# Altium schematic sheet 01-POWER.SchDoc
size A4
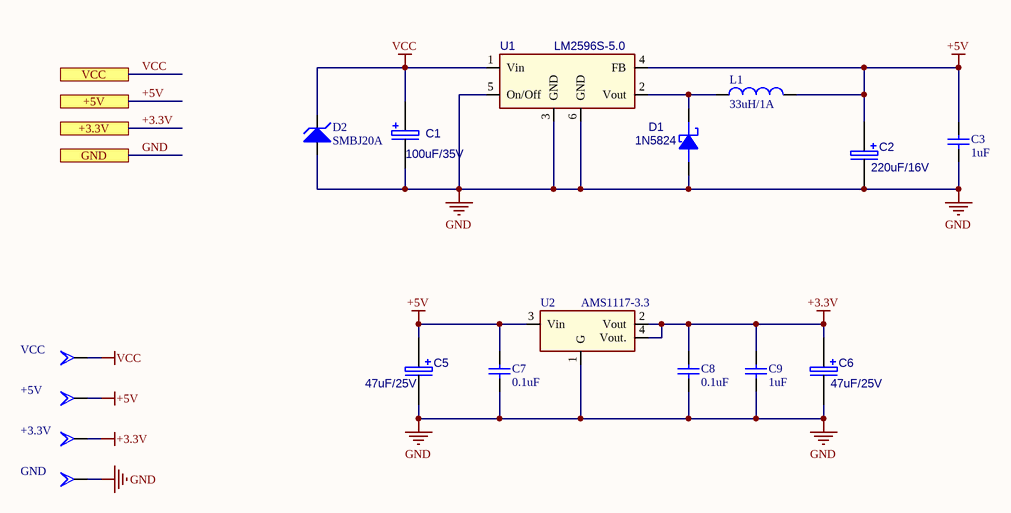
[diagram p0: 01-POWER.SchDoc]

## Parts
+3.3V  T POINT A  [TP_60_30]  (value not drawn)
+5V  T POINT A  [TP_60_30]  (value not drawn)
C1  100uF/35V  [CE06150]
C2  220uF/16V  [CE06150 - W]
C3  1uF  [0805_C]
C5  47uF/25V  [CE06150 - W]
C6  47uF/25V  [CE06150 - W]
C7  0.1uF  [0805_C]
C8  0.1uF  [0805_C]
C9  1uF  [0805_C]
D1  1N5824  [SMB-DO-214AA_DIOM4436X24N]
D2  SMBJ20A  [SMB-DO-214AA_DIOM4436X24N]
GND  T POINT A  [TP_60_30]  (value not drawn)
L1  33uH/1A  [SMD_S7-7-5]
U1  LM2596S-5.0  [TO-263-5]
U2  AMS1117-3.3  [SOT223]
VCC  T POINT A  [TP_60_30]  (value not drawn)

## Ports
+3.3V, +5V, GND, VCC

## Nets
+3.3V: +3.3V.1(TP) C6.1(+) C8.2 C9.2 U2.2(Vout) U2.4(Vout.) ; port +3.3V
+5V: +5V.1(TP) C2.1(+) C3.2 C5.1(+) C7.2 L1.2 U1.4(FB) U2.3(Vin) ; port +5V
GND: C1.2(-) C2.2(-) C3.1 C5.2(-) C6.2(-) C7.1 C8.1 C9.1 D1.1(ANODE) D2.1(A) GND.1(TP) U1.3(GND) U1.5(On/Off) U1.6(GND) U2.1(G) ; port GND
VCC: C1.1(+) D2.2(K) U1.1(Vin) VCC.1(TP) ; port VCC
NetD1_2: D1.2(CATHODE) L1.1 U1.2(Vout)

## Library data of the parts
C1 C2 C5 C6 = ECAP: E-CAP
C3 = Cap Semi: Capacitor; Published: 8-Jun-2000; LatestRevisionDate: 29-May-2009; LatestRevisionNote: IPC-7351 Footprint Added.; PackageReference: C1206; Publisher: Altium Limited; PackageDescription: Chip Capacitor
C7-C9 = Cap Semi_1: Capacitor; Published: 8-Jun-2000; LatestRevisionDate: 29-May-2009; LatestRevisionNote: IPC-7351 Footprint Added.; PackageReference: C1206; Publisher: Altium Limited; PackageDescription: Chip Capacitor
D1 = DIODE SCHOTTKY
D2 = D Zener: TVS; Published: 8-Jun-2000; LatestRevisionDate: 17-Jul-2002; LatestRevisionNote: Re-released for DXP Platform.; PackageReference: DIODE-0.7; Publisher: Altium Limited
L1 = Inductor: Code_IEC: 1005; Published: 8-Jun-2000; LatestRevisionDate: 29-May-2009; LatestRevisionNote: IPC-7351 Footprint Added.; PackageReference: 0402-A; Publisher: Altium Limited; PackageDescription: Chip Inductor; Code_JEITA: 0402
U1 = LM2596T-5.0